# EAGLE design Main (EAGLE 7.2.0)
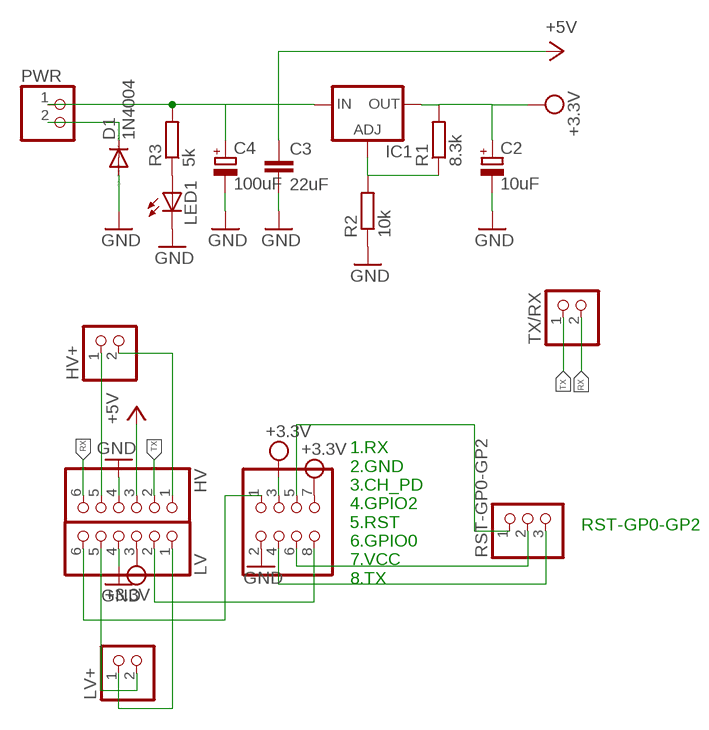
[diagram p0: schematic, sheet 1]

## Parts
C2  10uF  CPOL-EUE2-5  [E2-5]
C3  22uF  C-EU025-024X044  [C025-024X044]
C4  100uF  CPOL-EUE2.5-7  [E2,5-7]
D1  1N4004  [DO41-10]
HV  PINHD-1X6  [1X06]
HV+  PINHD-1X2  [1X02]
IC1  LM317TS  [317TS]
LED1  LED5MM  [LED5MM]
LV  PINHD-1X6  [1X06]
LV+  PINHD-1X2  [1X02]
PWR  PINHD-1X2  [1X02]
R1  8.3k  R-EU_0207/7  [0207/7]
R2  10k  R-EU_0207/7  [0207/7]
R3  5k  R-EU_0207/7  [0207/7]
RST-GP0-GP2  PINHD-1X3  [1X03]
SOCLU_ESP  PINHD-2X4  [2X04]
TX/RX  PINHD-1X2  [1X02]

## Nets
GND: C2.- C3.2 C4.- D1.A HV.4 LED1.K(C) LV.4 R2.1 SOCLU_ESP.2
N$1: LV.2 SOCLU_ESP.8
N$2: RST-GP0-GP2.1 SOCLU_ESP.5
N$3: RST-GP0-GP2.2 SOCLU_ESP.6
N$4: LV.6 SOCLU_ESP.1
N$5: RST-GP0-GP2.3 SOCLU_ESP.4
N$7: HV+.1 HV.5
N$8: HV+.2 HV.1
N$9: LV+.1 LV.1
N$11: LV+.2 LV.5
N$13: IC1.1(ADJ) R1.1 R2.2
N$15: D1.C PWR.2
N$16: LED1.A R3.1
RX: HV.6 TX/RX.2
TX: HV.2 TX/RX.1
VCC: C3.1 C4.+ HV.3 IC1.3(IN) PWR.1 R3.2 ; supply symbol labelled +5V
VDD: C2.+ IC1.2(OUT) LV.3 R1.2 SOCLU_ESP.3 SOCLU_ESP.7 ; supply symbol labelled +3.3V

## Notes on the sheet
- RST-GP0-GP2
- 1.RX
  2.GND
  3.CH_PD
  4.GPIO2
  5.RST
  6.GPIO0
  7.VCC
  8.TX

## Library data of the parts
C2 C4 = rcl:CPOL-EU: POLARIZED CAPACITOR, European symbol
C3 = rcl:C-EU: CAPACITOR, European symbol
D1 = diode:1N4004: DIODE general purpose rectifier, 1 A
HV LV = pinhead:PINHD-1X6: PIN HEADER
HV+ LV+ PWR TX/RX = pinhead:PINHD-1X2: PIN HEADER
IC1 = v-reg:LM317TS: VOLTAGE REGULATOR
LED1 = led:LED: LED OSRAM: - CHIPLED LG R971, LG N971, LY N971, LG Q971, LY Q971, LO R971, LY R971 LH N974, LH R974 LS Q976, LO Q976, LY Q976 LO Q996 - Hyper CHIPLED LW Q18S LB Q993, LB Q99A, LB R99A - SideLED LS A670, LO A670, LY A670, LG A670, LP A670 LB A673, LV A673, LT A673, LW A673 LH A674 LY A675 LS A676, LA A676, LO A676, LY A676, LW A676 LS A679, LY A679, LG A679 - Hyper Micro SIDELED® LS Y876, LA Y876, LO Y876, LY Y876 LT Y87S - SmartLED LW L88C, LW L88S LB L89C, LB L89S, LG L890 LS L89K, LO L89K, LY L89K LS L896, LA L896, LO L896, LY L896 - TOPLED LS T670, LO T670, LY T670, LG T670, LP T670 LSG T670, LSP T670, LSY T670, LOP T670, LYG T670 LG T671, LOG T671, LSG T671 LB T673, LV T673, LT T673, LW T673 LH T674 LS T676, LA T676, LO T676, LY T676, LB T676, LH T676, LSB T676, LW T676 LB T67C, LV T67C, LT T67C, LS T67K, LO T67K, LY T67K, LW E67C LS E67B, LA E67B, LO E67B, LY E67B, LB E67C, LV E67C, LT E67C LW T67C LS T679, LY T679, LG T679 LS T770, LO T770, LY T770, LG T770, LP T770 LB T773, LV T773, LT T773, LW T773 LH T774 LS E675, LA E675, LY E675, LS T675 LS T776, LA T776, LO T776, LY T776, LB T776 LHGB T686 LT T68C, LB T68C - Hyper Mini TOPLED® LB M676 - Mini TOPLED Santana® LG M470 LS M47K, LO M47K, LY M47K Source: http://www.osram.convergy.de LUXEON: - LUMILED® LXK2-PW12-R00, LXK2-PW12-S00, LXK2-PW14-U00, LXK2-PW14-V00 LXK2-PM12-R00, LXK2-PM12-S00, LXK2-PM14-U00 LXK2-PE12-Q00, LXK2-PE12-R00, LXK2-PE12-S00, LXK2-PE14-T00, LXK2-PE14-U00 LXK2-PB12-K00, LXK2-PB12-L00, LXK2-PB12-M00, LXK2-PB14-N00, LXK2-PB14-P00, LXK2-PB14-Q00 LXK2-PR12-L00, LXK2-PR12-M00, LXK2-PR14-Q00, LXK2-PR14-R00 LXK2-PD12-Q00, LXK2-PD12-R00, LXK2-PD12-S00 LXK2-PH12-R00, LXK2-PH12-S00 LXK2-PL12-P00, LXK2-PL12-Q00, LXK2-PL12-R00 Source: www.luxeon.com KINGBRIGHT: KA-3528ASYC Source: www.kingbright.com
R1-R3 = rcl:R-EU_: RESISTOR, European symbol
RST-GP0-GP2 = pinhead:PINHD-1X3: PIN HEADER
SOCLU_ESP = pinhead:PINHD-2X4: PIN HEADER

## Net classes
0 default: width 0.032 mm, drill 0.032 mm

## Board
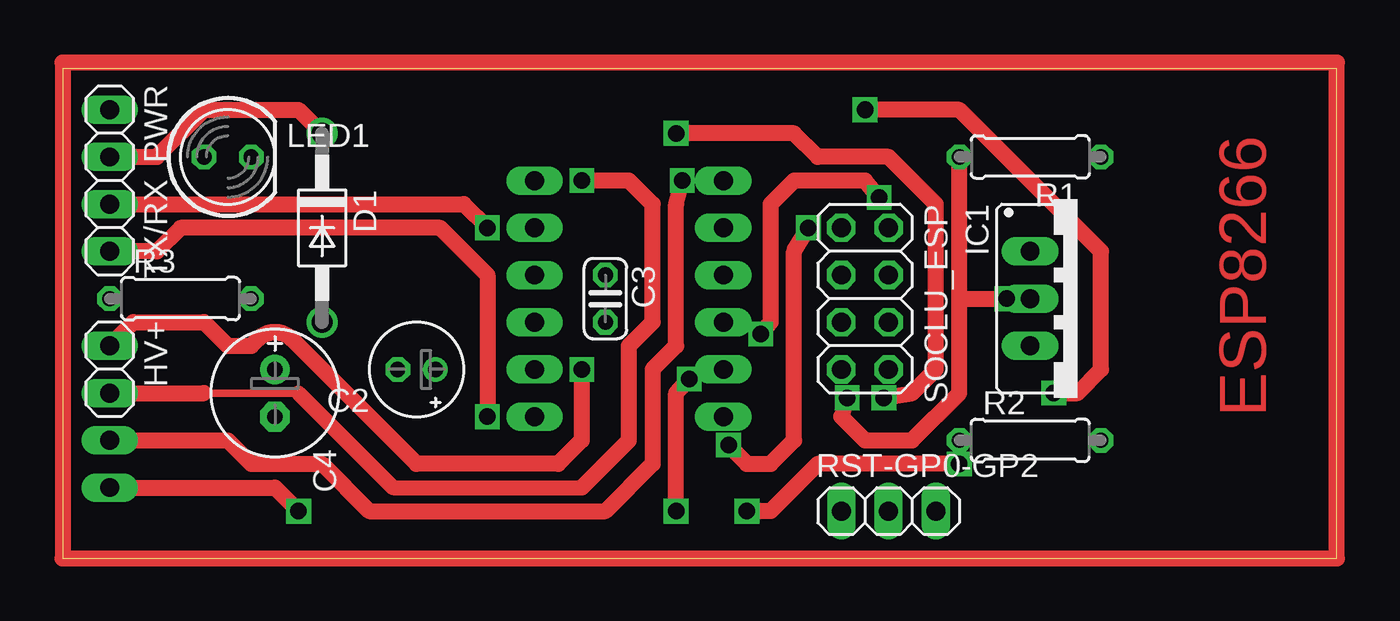
[diagram p1: board, top side]
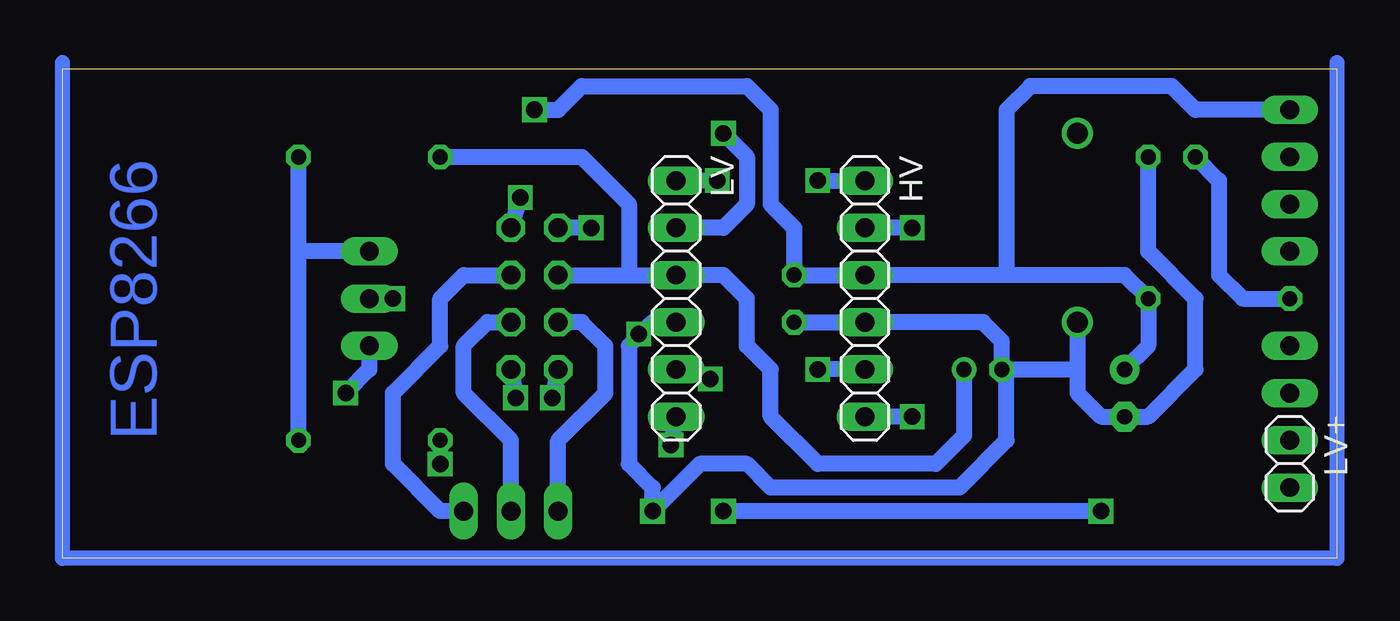
[diagram p2: board, bottom side, seen from below]

Size 68.56 x 26.34 mm. Coordinates in mm from the lower left corner, seen from the top.
Outline: 0,0 68.56,0 68.56,26.34 0,26.34 0,0
Copper layers (1*16): Top 0.035mm / dielectric 1.5mm / Bottom 0.035mm
Design rules "default *": minimum track width 34mil, minimum drill 35mil, track to track 10mil, track to pad 10mil, pad to pad 8mil, via to via 8mil, smd to smd 8mil, copper to edge 40mil, drill to drill 8mil, minimum pad ring 10mil, minimum via ring 8mil, stop-mask expansion 4mil, vias tented up to drill 0mil, thermal gap 10mil

### Footprints (pad centres in the part's own frame; a part is rotated, then mirrored left to right if it is on the bottom)
E2-5 = drill 0.813 pad 1.27: + -1.016,0 | drill 0.813 pad 1.27 octagon: - 1.016,0
C025-024X044 = drill 0.813 octagon: 1 -1.27,0; 2 1.27,0
E2,5-7 = drill 0.813 pad 1.6: + -1.27,0 | drill 0.813 pad 1.6 octagon: - 1.27,0
DO41-10 = drill 1.118: A 5.08,0; C -5.08,0
1X06 = drill 1.016 long: 1 -6.35,0; 2 -3.81,0; 3 -1.27,0; 4 1.27,0; 5 3.81,0; 6 6.35,0
1X02 = drill 1.016 long: 1 -1.27,0; 2 1.27,0
317TS = drill 1.016 long: 1 -2.54,-2.54; 2 0,-2.54; 3 2.54,-2.54
LED5MM = drill 0.813 octagon: A -1.27,0; K 1.27,0
0207/7 = drill 0.813 octagon: 1 -3.81,0; 2 3.81,0
1X03 = drill 1.016 long: 1 -2.54,0; 2 0,0; 3 2.54,0
2X04 = drill 1.016 octagon: 1 -3.81,-1.27; 2 -3.81,1.27; 3 -1.27,-1.27; 4 -1.27,1.27; 5 1.27,-1.27; 6 1.27,1.27; 7 3.81,-1.27; 8 3.81,1.27

### Placement (x,y rotation side)
C2  19.05,10.16 180 top
C3  29.21,13.97 270 top
C4  11.43,8.89 270 top
D1  13.97,17.78 270 top
HV  25.4,13.97 270 bottom
HV+  2.54,10.16 270 top
IC1  54.61,13.97 270 top
LED1  8.89,21.59 0 top
LV  35.56,13.97 270 bottom
LV+  2.54,5.08 270 bottom
PWR  2.54,22.86 270 top
R1  52.07,21.59 180 top
R2  52.07,6.35 0 top
R3  6.35,13.97 0 top
RST-GP0-GP2  44.45,2.54 0 top
SOCLU_ESP  43.18,13.97 270 top
TX/RX  2.54,17.78 270 top

### Tracks (layer width: path | path; a pad name or v marks a point on that pad's centre or on a via)
GND  (via drill 0.89)
  Top 0.864: v43.94,19.41 43.18,20.32 39.37,20.32 38.1,19.05 38.1,12.7 v37.57,12.06 | v48.26,5.08 40.64,5.08 38.1,2.54 v36.83,2.54
  Bottom 0.864: LED1.K 10.16,16.51 7.62,13.97 7.62,10.16 10.16,7.62 C4.- 12.7,7.62 13.97,8.89 13.97,10.16 | D1.A 13.97,10.16 | C2.- 13.97,10.16 | C2.- 18.03,11.68 19.05,12.7 HV.4 C3.2 | LV.4 36.83,12.7 v37.57,12.06 38.1,11.43 38.1,5.08 36.83,3.81 v36.83,2.54 34.29,5.08 31.75,5.08 30.48,3.81 20.32,3.81 17.78,6.35 17.78,9.91 C2.- | SOCLU_ESP.2 v43.94,19.41 | R2.1 v48.26,5.08
N$1  (via drill 0.89)
  Top 0.864: v44.2,8.64 45.72,8.89 46.99,10.16 46.99,19.05 44.45,21.59 40.64,21.59 39.37,22.86 v33.02,22.86
  Bottom 0.864: SOCLU_ESP.8 v44.2,8.64 | v33.02,22.86 31.75,21.59 31.75,19.05 33.02,17.78 LV.2
N$2
  Bottom 0.864: RST-GP0-GP2.1 41.91,6.35 39.37,8.89 39.37,11.43 40.64,12.7 SOCLU_ESP.5
N$3
  Bottom 0.864: RST-GP0-GP2.2 44.45,6.35 46.99,8.89 46.99,11.43 45.72,12.7 SOCLU_ESP.6
N$4  (via drill 0.89)
  Top 0.864: v35.84,6.1 36.83,5.08 38.1,5.08 39.37,6.35 39.37,16.51 v40.13,17.78
  Bottom 0.864: LV.6 v35.84,6.1 | v40.13,17.78 SOCLU_ESP.1
N$5
  Bottom 0.864: RST-GP0-GP2.3 48.26,2.54 50.8,5.08 50.8,8.89 48.26,11.43 48.26,13.97 46.99,15.24 SOCLU_ESP.4
N$7  (via drill 0.89)
  Top 0.864: v27.94,10.16 27.94,6.35 26.67,5.08 19.05,5.08 12.33,11.8 arc90 10.53,11.8 10.16,11.43 8.89,11.43 7.62,12.7 3.81,12.7 HV+.1
  Bottom 0.864: HV.5 v27.94,10.16
N$8  (via drill 0.89)
  Top 0.406: 7.62,8.89 12.7,8.89
  Top 0.813: 12.7,8.89 17.78,3.81 27.94,3.81
  Top 0.864: HV+.2 7.62,8.89 | 27.94,3.81 30.48,6.35 30.48,11.43 31.75,12.7 31.75,19.05 30.48,20.32 v27.94,20.32
  Bottom 0.864: v27.94,20.32 HV.1
N$9  (via drill 0.89)
  Top 0.864: LV+.1 8.89,6.35 10.16,5.08 13.97,5.08 16.51,2.54 29.21,2.54 31.75,5.08 31.75,10.16 33.02,11.43 33.02,19.05 v33.35,20.32
  Bottom 0.864: v33.35,20.32 LV.1
N$10
  Bottom 0.813: 0,26.67 0,0 68.58,0 68.58,26.67
N$11  (via drill 0.89)
  Top 0.864: LV+.2 11.43,3.81 v12.7,2.54 | v33.02,2.54 33.02,8.89 v33.72,9.65
  Bottom 0.864: v12.7,2.54 v33.02,2.54 | v33.72,9.65 LV.5
N$12
  Top 0.864: 0,26.67 0,0 68.58,0 68.58,26.67 0,26.67
N$13
  Bottom 0.864: R2.2 55.88,16.51 | 55.88,16.51 R1.1 | IC1.1 55.88,16.51
N$15
  Top 0.864: PWR.2 5.08,21.59 7.62,24.13 12.7,24.13 D1.C
N$16
  Bottom 0.864: LED1.A 6.35,20.32 6.35,15.24 5.08,13.97 R3.1
RX  (via drill 0.89)
  Top 0.864: v22.86,7.62 22.86,15.24 20.32,17.78 6.35,17.78 5.08,16.51 TX/RX.2
  Bottom 0.864: v22.86,7.62 HV.6
TX  (via drill 0.89)
  Top 0.864: TX/RX.1 21.59,19.05 v22.86,17.78
  Bottom 0.864: v22.86,17.78 HV.2
VCC  (via drill 0.89)
  Top 0.864: v53.34,8.89 54.61,8.89 55.88,10.16 55.88,16.51 48.26,24.13 v43.18,24.13
  Bottom 0.864: C4.+ 10.16,11.43 R3.2 11.43,15.24 17.78,15.24 | IC1.3 52.07,10.16 v53.34,8.89 | v43.18,24.13 41.91,24.13 40.64,25.4 31.75,25.4 30.48,24.13 30.48,19.05 29.21,17.78 C3.1 HV.3 17.78,15.24 | PWR.1 7.62,24.13 8.89,25.4 16.51,25.4 17.78,24.13 17.78,15.24
VDD  (via drill 0.89)
  Top 0.864: v42.22,8.64 41.91,7.62 43.18,6.35 45.72,6.35 48.26,8.89 48.26,13.97 | 48.26,13.97 R1.2 | 48.26,13.97 v50.8,13.97
  Bottom 0.864: C2.+ 20.07,6.6 21.59,5.08 27.94,5.08 30.48,7.62 30.48,10.16 31.75,11.43 31.75,13.97 33.02,15.24 LV.3 38.1,15.24 | SOCLU_ESP.3 38.1,15.24 | R1.2 40.64,21.59 38.1,19.05 38.1,15.24 | SOCLU_ESP.7 v42.22,8.64 | v50.8,13.97 IC1.2

### Text on the board
Top: ESP8266
Bottom: ESP8266